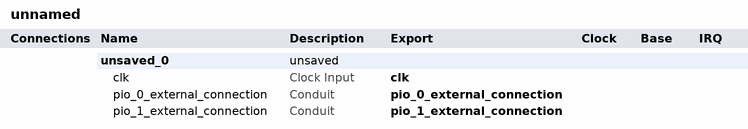
[diagram p0: system contents]
# Platform Designer (Qsys) system unnamed, Cyclone IV E EP4CE22F17C6
# Parameters at their usual value, and those the tool derives, are not listed.
package require qsys
create_system unnamed
set_project_property DEVICE_FAMILY {Cyclone IV E}
set_project_property DEVICE EP4CE22F17C6

add_instance unsaved_0 unsaved 1.0
set_instance_property unsaved_0 AUTO_EXPORT true

# exported interfaces
add_interface clk clock sink
set_interface_property clk EXPORT_OF unsaved_0.clk
add_interface pio_0_external_connection conduit end
set_interface_property pio_0_external_connection EXPORT_OF unsaved_0.pio_0_external_connection
add_interface pio_1_external_connection conduit end
set_interface_property pio_1_external_connection EXPORT_OF unsaved_0.pio_1_external_connection

set_interconnect_requirement {$system} qsys_mm.clockCrossingAdapter HANDSHAKE
set_interconnect_requirement {$system} qsys_mm.enableEccProtection FALSE
set_interconnect_requirement {$system} qsys_mm.insertDefaultSlave FALSE
set_interconnect_requirement {$system} qsys_mm.maxAdditionalLatency 1

save_system unnamed.qsys
